# Altium schematic sheet Multivibrator.SchDoc
size A4
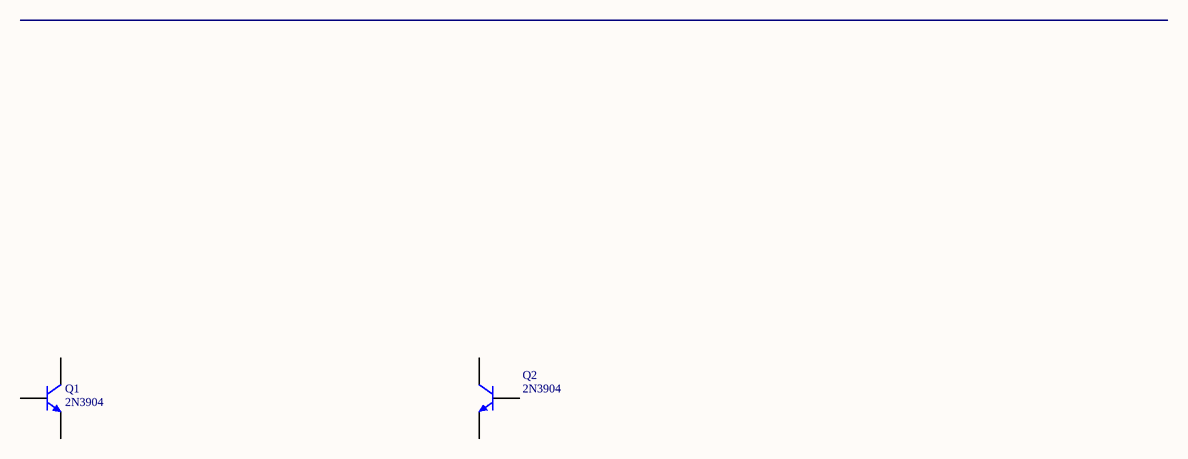
[diagram p0: Multivibrator.SchDoc]

## Parts
Q1  2N3904  [TO-92A]
Q2  2N3904  [TO-92A]

## Nets

Not connected (* = marked no-connect by the designer): Q1 1(E) 2(B) 3(C); Q2 1(E) 2(B) 3(C)

## Library data of the parts
Q1 Q2 = 2N3904: NPN General Purpose Amplifier; Published: 8-Jun-2000; LatestRevisionDate: 15-Jan-2003; LatestRevisionNote: PCB Footprint 'BCY-W3/D4.7' replaced; DatasheetVersion: 1997; PackageVersion: Sep-1998; PackageReference: TO-92A; Publisher: Altium Limited; PackageDescription: TO, Flat Index; 3 In-Line, Axial Leads; Body Dia. 4.5mm; Leads 0.51 x 0.48 mm (max); ComponentLink1Description: Manufacturer Link; ComponentLink1URL: http://www.fairchildsemi.com/; ComponentLink2Description: Datasheet; ComponentLink2URL: http://www.fairchildsemi.com/ds/2N%2F2N3904.pdf